# Altium schematic sheet ESP32_Dongle.SchDoc
size A2
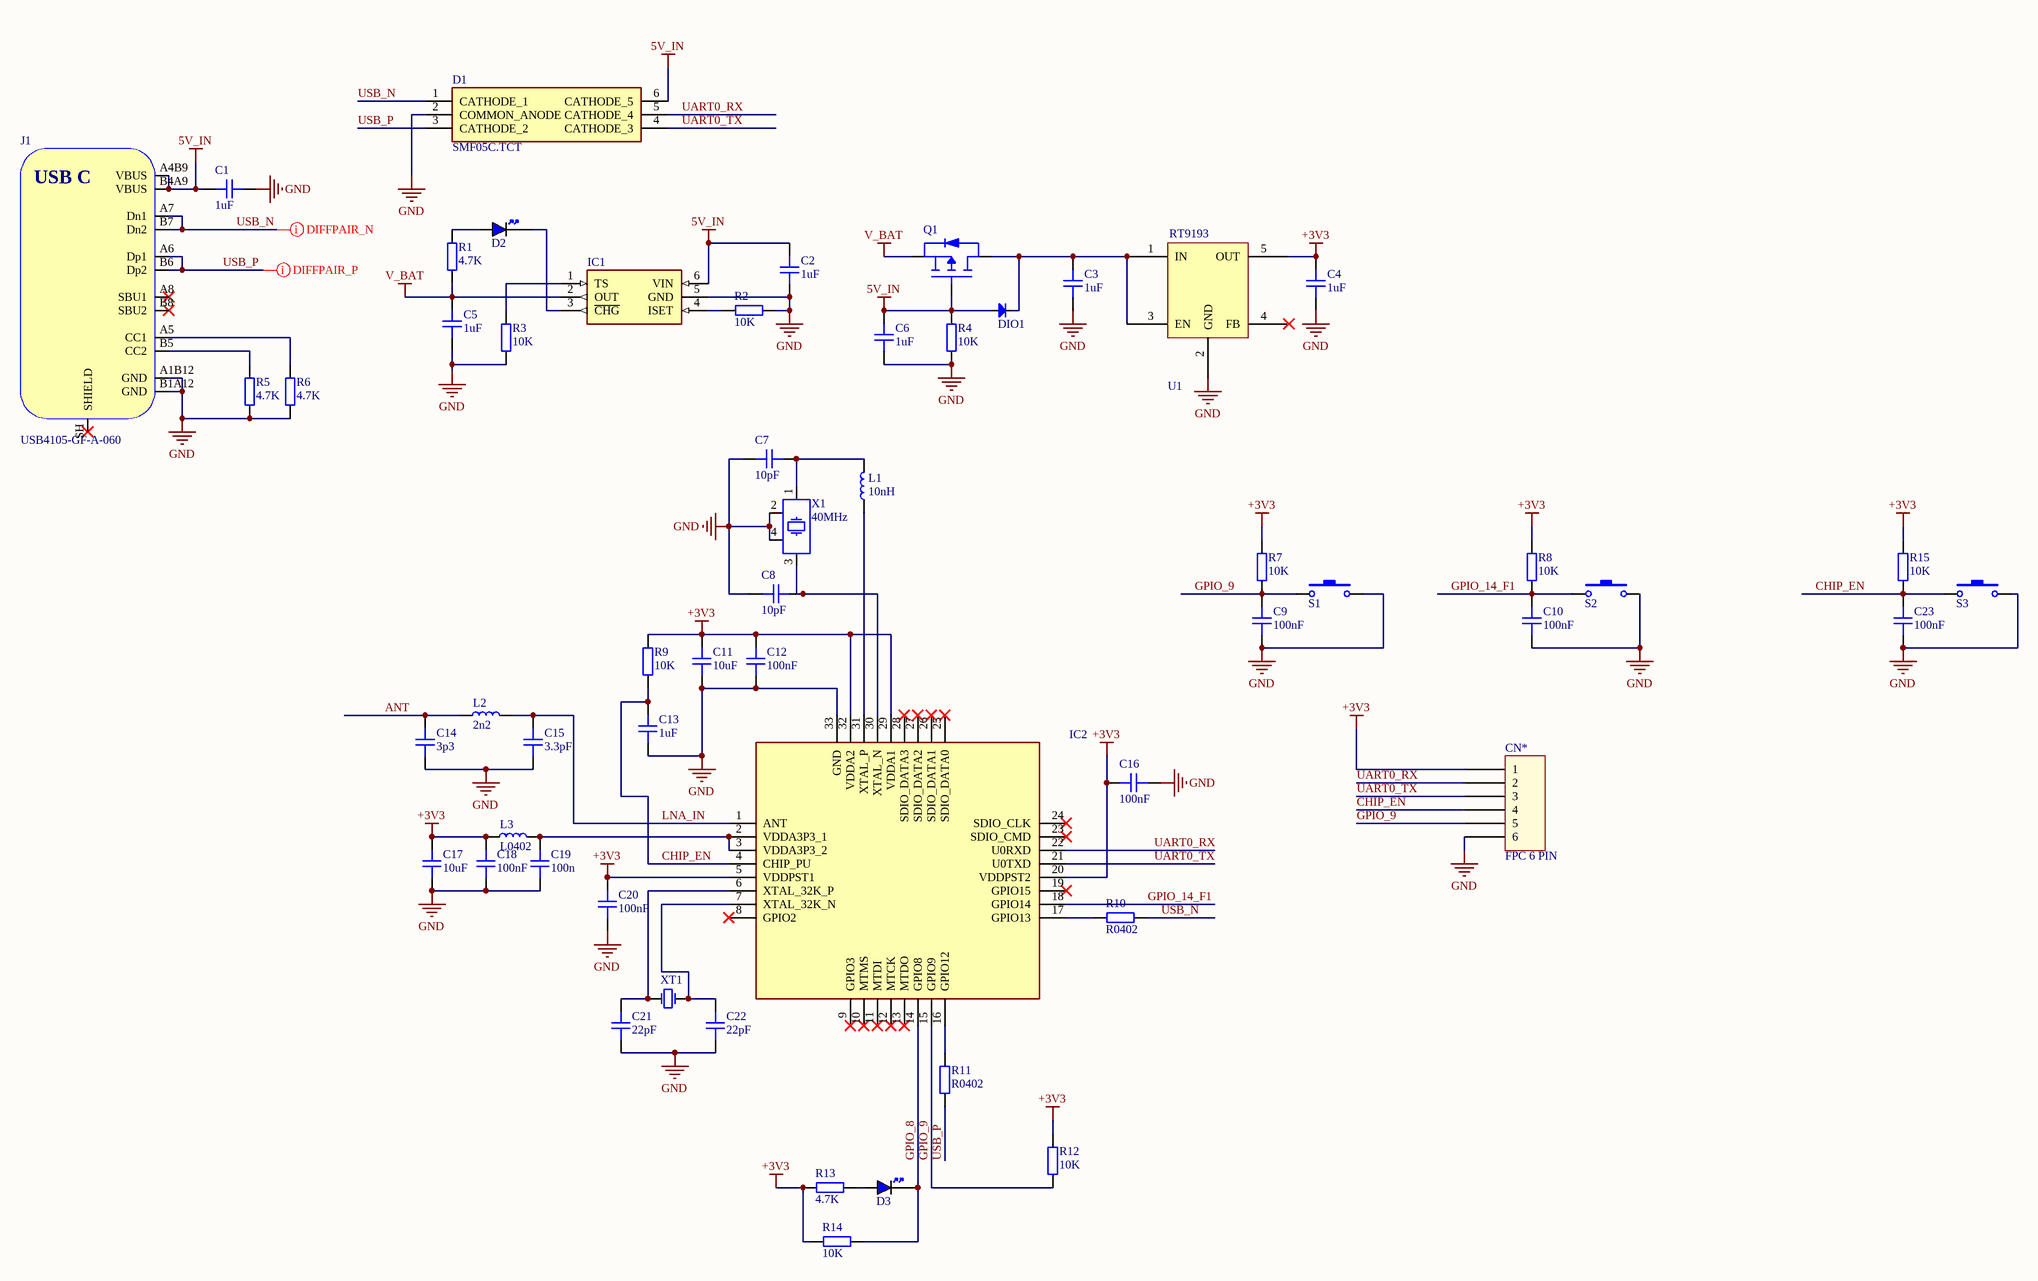
[diagram p0: ESP32_Dongle.SchDoc]

## Parts
C1  1uF  [CAP_0603]
C2  1uF  [CAP_0603]
C3  1uF  [CAP_0603]
C4  1uF  [CAP_0603]
C5  1uF  [CAP_0603]
C6  1uF  [CAP_0603]
C7  10pF  [CAP_0402]
C8  10pF  [CAP_0402]
C9  100nF  [CAP_0402]
C10  100nF  [CAP_0402]
C11  10uF  [CAP_0603]
C12  100nF  [CAP_0402]
C13  1uF  [CAP_0603]
C14  3p3  [CAP_0402]
C15  3.3pF  [CAP_0402]
C16  100nF  [CAP_0603]
C17  10uF  [CAP_0603]
C18  100nF  [CAP_0402]
C19  100n  [CAP_0402]
C20  100nF  [CAP_0603]
C21  22pF  [CAP_0402]
C22  22pF  [CAP_0402]
C23  100nF  [CAP_0402]
CN*  FPC 6 PIN  [FPC 6 PIN]
D1  SMF05C.TCT  [SM05F]
D2  LED_C  [LED_0603_BLUE]  (value not drawn)
D3  BLUE  [LED_0603_BLUE]  (value not drawn)
DIO1  1N4007  [DIO-SMD-123]  (value not drawn)
IC1  BQ21040DBVR  [BQ21040DBVR]  (value not drawn)
IC2  ESP32-C6FH4  [esp32 c6FH4]  (value not drawn)
J1  USB4105-GF-A-060  [USB4105-GF-A-060]
L1  10nH  [IND_0402]
L2  2n2  [IND_0402]
L3  L0402  [IND_0402]
Q1  SSM3J338R,LF  [SSM3J338R,LF-SOT23-F]  (value not drawn)
R1  4.7K  [RES_0402]
R2  10K  [RES_0402]
R3  10K  [RES_0402]
R4  10K  [RES_0402]
R5  4.7K  [RES_0402]
R6  4.7K  [RES_0402]
R7  10K  [RES_0402]
R8  10K  [RES_0402]
R9  10K  [RES_0402]
R10  R0402  [RES_0402]
R11  R0402  [RES_0402]
R12  10K  [RES_0402]
R13  4.7K  [RES_0402]
R14  10K  [RES_0402]
R15  10K  [RES_0402]
S1  SW-SMD  [SW-SMD]  (value not drawn)
S2  SW-SMD  [SW-SMD]  (value not drawn)
S3  SW-SMD  [SW-SMD]  (value not drawn)
U1  RT9193-33  [RT9193_33]  (value not drawn)
X1  40MHz  [XTAL_3225]
XT1  32.768KHz  [CRYSTAL_SMD_3.2X1.5]  (value not drawn)

## Nets
5V_IN: C1.1 C2.1 C6.1 D1.6(CATHODE_5) DIO1.1(A) IC1.6(VIN) J1.A4B9(VBUS) J1.B4A9(VBUS) Q1.G R4.2
+3V3: C4.1 C11.2 C12.2 C16.2 C17.2 C18.2 C20.2 CN*.1 IC2.5(VDDPST1) IC2.20(VDDPST2) IC2.29(VDDA1) IC2.32(VDDA2) L3.1 R7.2 R8.2 R9.2 R12.2 R13.1 R14.1 R15.2 U1.5(OUT)
GND: C1.2 C2.2 C3.2 C4.2 C5.2 C6.2 C7.2 C8.2 C9.1 C10.1 C11.1 C12.1 C13.1 C14.1 C15.1 C16.1 C17.1 C18.1 C19.1 C20.1 C21.2 C22.2 C23.1 CN*.6 D1.2(COMMON_ANODE) IC1.5(GND) IC2.33(GND) J1.A1B12(GND) J1.B1A12(GND) R2.2 R3.2 R4.1 R5.1 R6.1 S1.2 S2.2 S3.2 U1.2(GND) X1.2 X1.4
V_BAT: C5.1 IC1.2(OUT) Q1.S R1.1
ANT: C14.2 L2.2
CHIP_EN: C13.2 C23.2 CN*.4 IC2.4(CHIP_PU) R9.1 R15.1 S3.1
GPIO_8: D3.K IC2.14(GPIO8) R14.2
GPIO_9: C9.2 CN*.5 IC2.15(GPIO9) R7.1 R12.1 S1.1
GPIO_14_F1: C10.2 IC2.18(GPIO14) R8.1 S2.1
LNA_IN: C15.2 IC2.1(ANT) L2.1
UART0_RX: CN*.2 D1.5(CATHODE_4) IC2.22(U0RXD)
UART0_TX: CN*.3 D1.4(CATHODE_3) IC2.21(U0TXD)
USB_N: D1.1(CATHODE_1) J1.A7(Dn1) J1.B7(Dn2) R10.2
USB_P: D1.3(CATHODE_2) J1.A6(Dp1) J1.B6(Dp2) R11.1
NetC3_1: C3.1 DIO1.2(K) Q1.D U1.1(IN) U1.3(EN)
NetC7_1: C7.1 L1.2 X1.1
NetC8_1: C8.1 IC2.30(XTAL_N) X1.3
NetC19_2: C19.2 IC2.2(VDDA3P3_1) IC2.3(VDDA3P3_2) L3.2
NetC21_1: C21.1 IC2.6(XTAL_32K_P) XT1.1(OSC1)
NetC22_1: C22.1 IC2.7(XTAL_32K_N) XT1.2(OSC2)
NetD2_A: D2.A R1.2
NetD2_K: D2.K IC1.3(~{CHG})
NetD3_A: D3.A R13.2
NetIC1_1: IC1.1(TS) R3.1
NetIC1_4: IC1.4(ISET) R2.1
NetIC2_16: IC2.16(GPIO12) R11.2
NetIC2_17: IC2.17(GPIO13) R10.1
NetIC2_31: IC2.31(XTAL_P) L1.1
NetJ1_A5: J1.A5(CC1) R6.2
NetJ1_B5: J1.B5(CC2) R5.2

Not connected (* = marked no-connect by the designer): IC2 8(GPIO2)* 9(GPIO3)* 10(MTMS)* 11(MTDI)* 12(MTCK)* 13(MTDO)* 19(GPIO15)* 23(SDIO_CMD)* 24(SDIO_CLK)* 25(SDIO_DATA0)* 26(SDIO_DATA1)* 27(SDIO_DATA2)* 28(SDIO_DATA3)*; J1 A8(SBU1)* B8(SBU2)* SH(SHIELD)*; U1 4(FB)*

## Layout directives
differential pair; differential pair class P: USB_P
differential pair; differential pair class N: USB_N

## Notes on the sheet
- (in symbol RT9193-33) RT9193
- (in symbol USB4105-GF-A-060) USB C

## Library data of the parts
C1-C6 C11 C13 C16 C17 C20 = CAP_0603_10V: Capacitor SMD 0603 10V; Manufacturer: Samsung; Manufacturer Part Number: CL10A106KP8NNNC; LCSC: C19702
C7 C8 C21 C22 = CAP_0402_50V: Capacitor SMD 0402 50V; Manufacturer: Samsung; Manufacturer Part Number: CL05C100JB5NNNC; LCSC: C32949
C9 C10 C12 C18 C19 C23 = CAP_0402_50V: Capacitor SMD 0402 50V; Manufacturer: Samsung; Manufacturer Part Number: CL05B104KO5NNNC; LCSC: C1525
C14 C15 = CAP_0402_50V: Capacitor SMD 0402 50V; Manufacturer: FH; Manufacturer Part Number: 0402CG3R3C500NT; LCSC: C1565
CN* = FPC 6 PIN: FPC 6 Pin 0.5mm
D1 = SMF05C.TCT: TVS Diode (Uni-directional); Manufacturer_Name: SEMTECH; Datasheet Link: https://www.mouser.co.uk/datasheet/2/761/smf05c-1278099.pdf; Height: 1.1mm; Manufacturer_Part_Number: SMF05C.TCT; Mouser Part Number: 947-SMF05C.TCT; Mouser Price/Stock: https://www.mouser.co.uk/ProductDetail/Semtech/SMF05C.TCT?qs=rBWM4%252BvDhIcdGOAFdL4XAA%3D%3D; Arrow Part Number: SMF05C.TCT; Arrow Price/Stock: https://www.arrow.com/en/products/smf05c.tct/semtech?region=nac
D2 D3 = LED_0603_BLUE: LED 0603 BLUE SMD
DIO1 = Diode SMD: Default Diode; Code - JEDEC: DO-214-AB; Value: 1N5007; Published: 8-Jun-2000; Revision: July-2002: Re-released for DXP Platform.; Publisher: Altium Limited
IC1 = BQ21040DBVR: Pin Charger IC; Manufacturer_Name: Texas Instruments; Datasheet Link: http://www.ti.com/lit/gpn/bq21040; Height: 1.45mm; Manufacturer_Part_Number: BQ21040DBVR; Mouser Part Number: 595-BQ21040DBVR; Mouser Price/Stock: https://www.mouser.co.uk/ProductDetail/Texas-Instruments/BQ21040DBVR?qs=cttFivMKqWyovUuY6Xwwcw%3D%3D; Arrow Part Number: BQ21040DBVR; Arrow Price/Stock: https://www.arrow.com/en/products/bq21040dbvr/texas-instruments?region=nac
IC2 = ESP32-C6FH4: Integrated Circuit; Manufacturer_Name: Espressif Systems; Datasheet Link: https://www.mouser.ch/ProductDetail/Espressif-Systems/ESP32-C6FH4?qs=sGAEpiMZZMu3sxpa5v1qriveB5Rxa06Y9iJOmwW58jU%3D; Height: 0.9mm; Manufacturer_Part_Number: ESP32-C6FH4; Mouser Part Number: 356-ESP32-C6FH4; Mouser Price/Stock: https://www.mouser.co.uk/ProductDetail/Espressif-Systems/ESP32-C6FH4?qs=Imq1NPwxi77uZvg%252BuAIiXA%3D%3D
J1 = USB4105-GF-A-060: USB Connector Type C SMT 12 Pin; Manufacturer: GCT; Manufacturer Part Number: USB4105-GF-A-060
L1 L3 = IND_0402: Inductor SMD 0402
L2 = IND_0402: Inductor SMD 0402; Manufacturer: Murata; Manufacturer Part Number: LQW15AN2N2G80D; LCSC: C412264
Q1 = SSM3J338R,LF: MOSFET P-Channel Vds=12V Id=6A; Manufacturer Part Number: Toshiba; Manufacturer: SSM3J338R,LF
R1-R15 = RES_0402: Resistor SMD 0402
S1-S3 = SW-SMD: Switch; Published: 24-Mar-1999; LatestRevisionDate: 17-Jul-2002; LatestRevisionNote: Re-released for DXP Platform.; PackageReference: SPST-2; Publisher: Altium Limited
X1 = TSX-3225_24.0000MF15X-AC: Crystal SMD 24MHz 10PPM 7pF 3225; Manufacturer: Epson; Manufacturer Number: TSX-3225 24.0000MF15X-AC; ESR: 40R; Value: 24MHz; Type: XTAL; Load Capacitance: 7pF
XT1 = XTAL_Crystal: Value: 32.768KHz; URL: http://thegioiic.com/products/32-768khz-crystal-c3215